# EAGLE board 9-de-8 (EAGLE 6.6.0), part 1 of 3
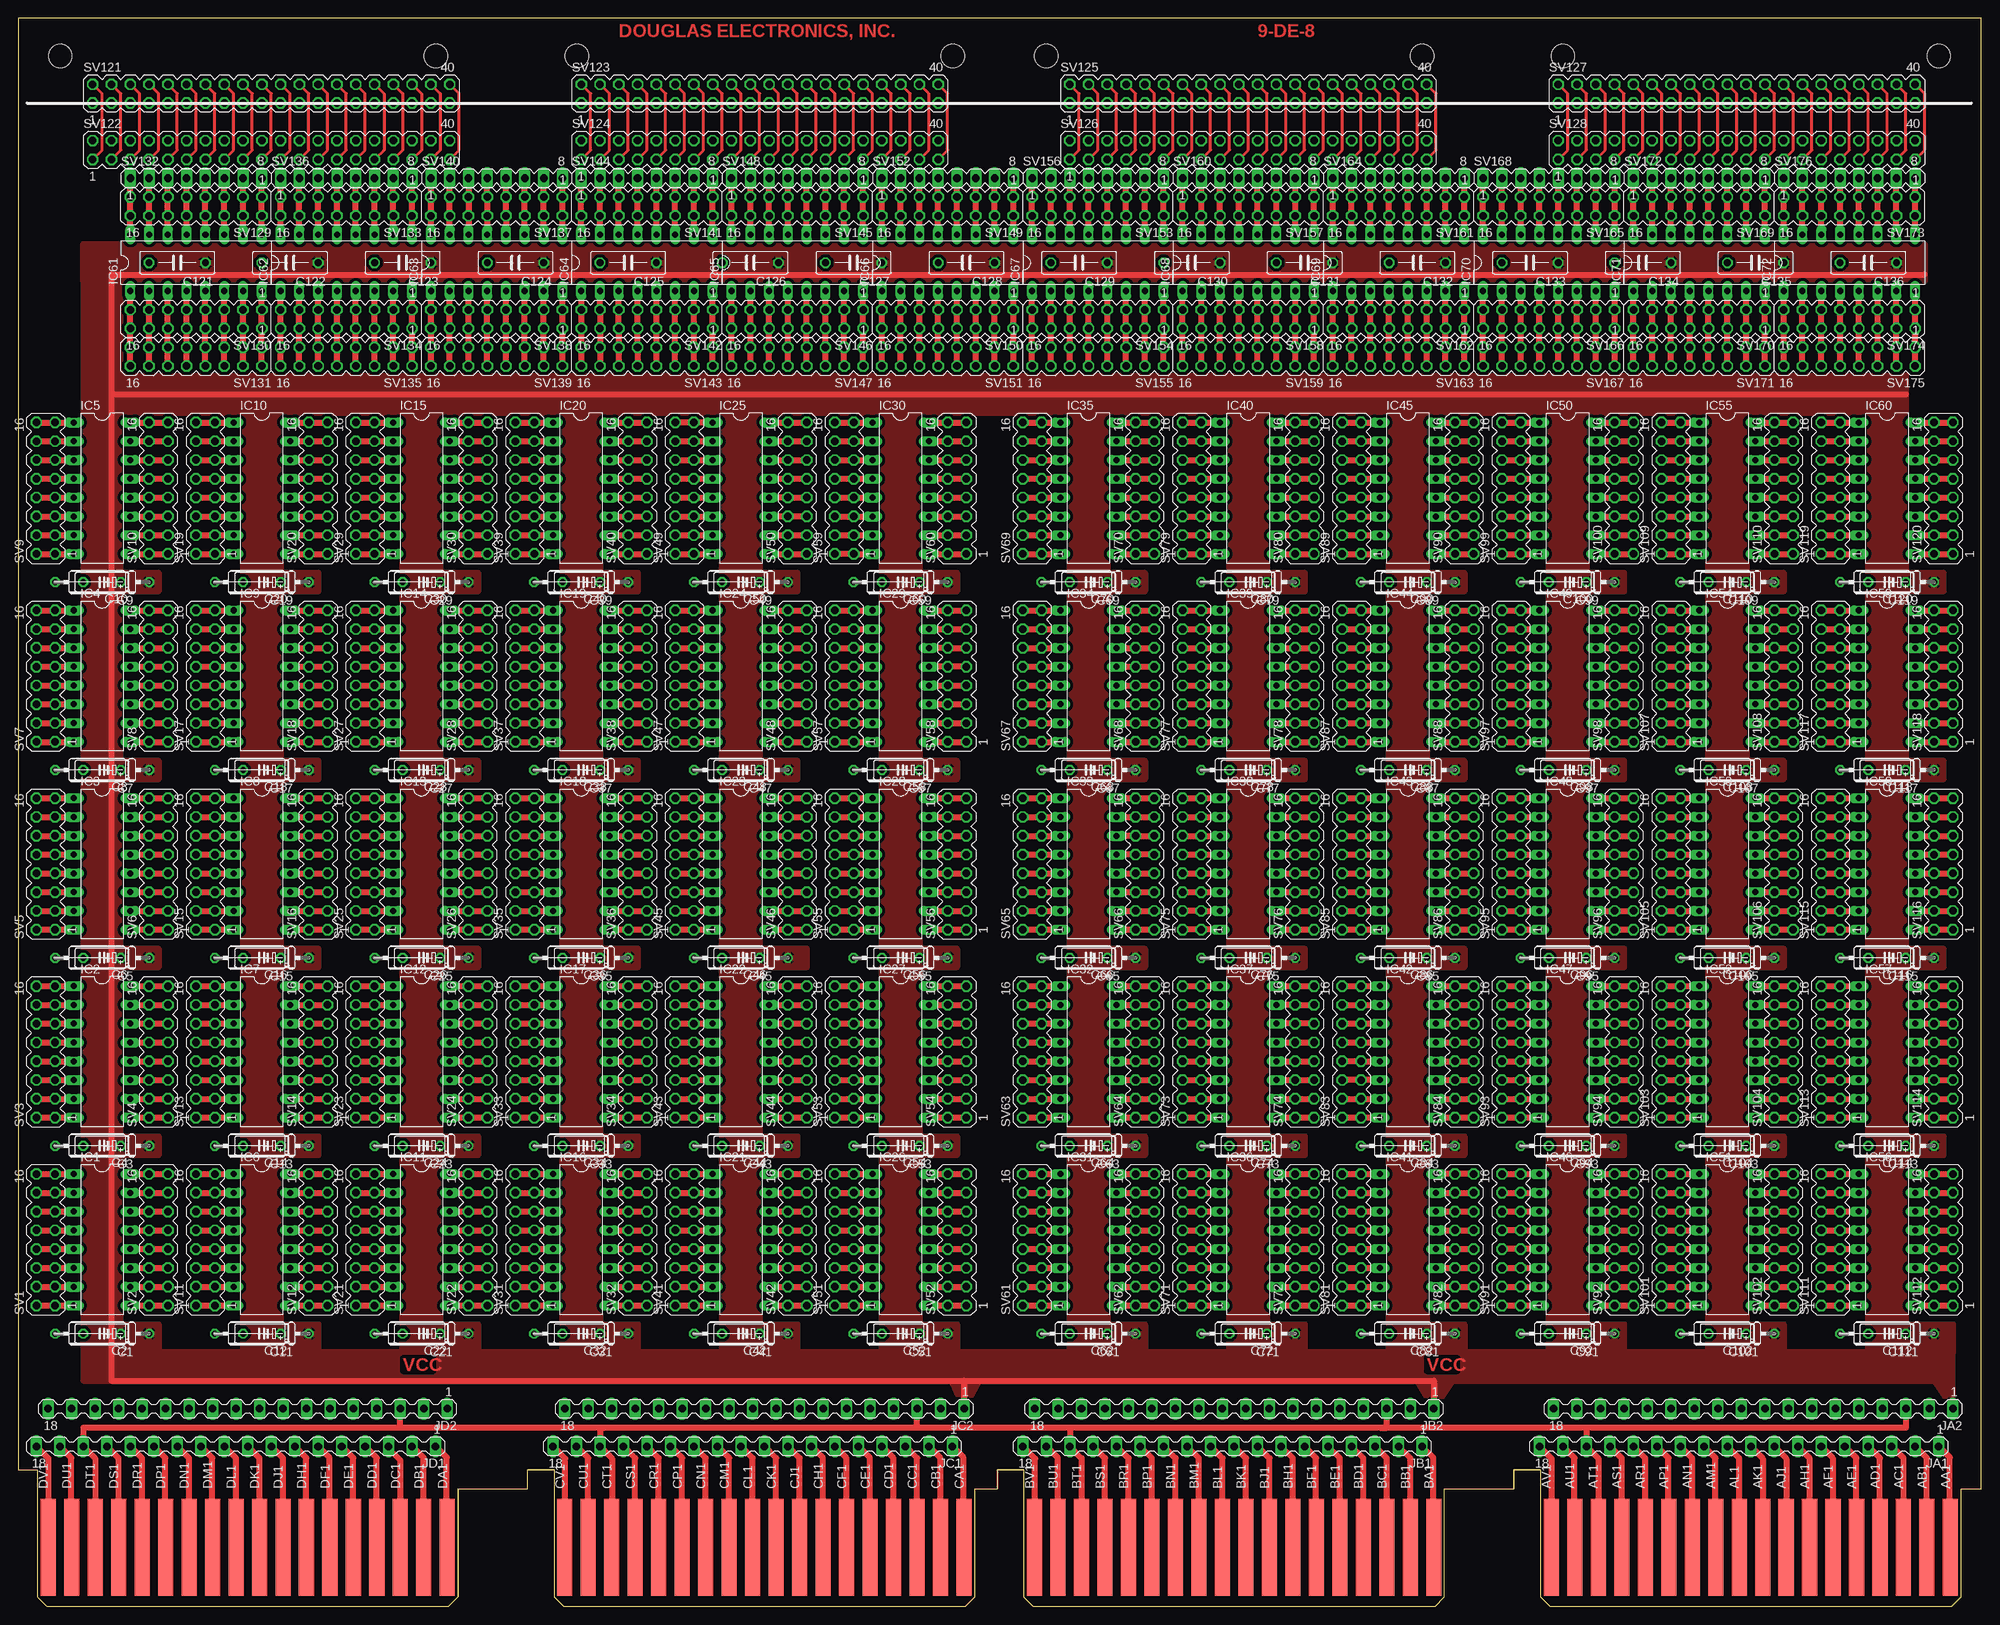
[diagram p3: board, top side]
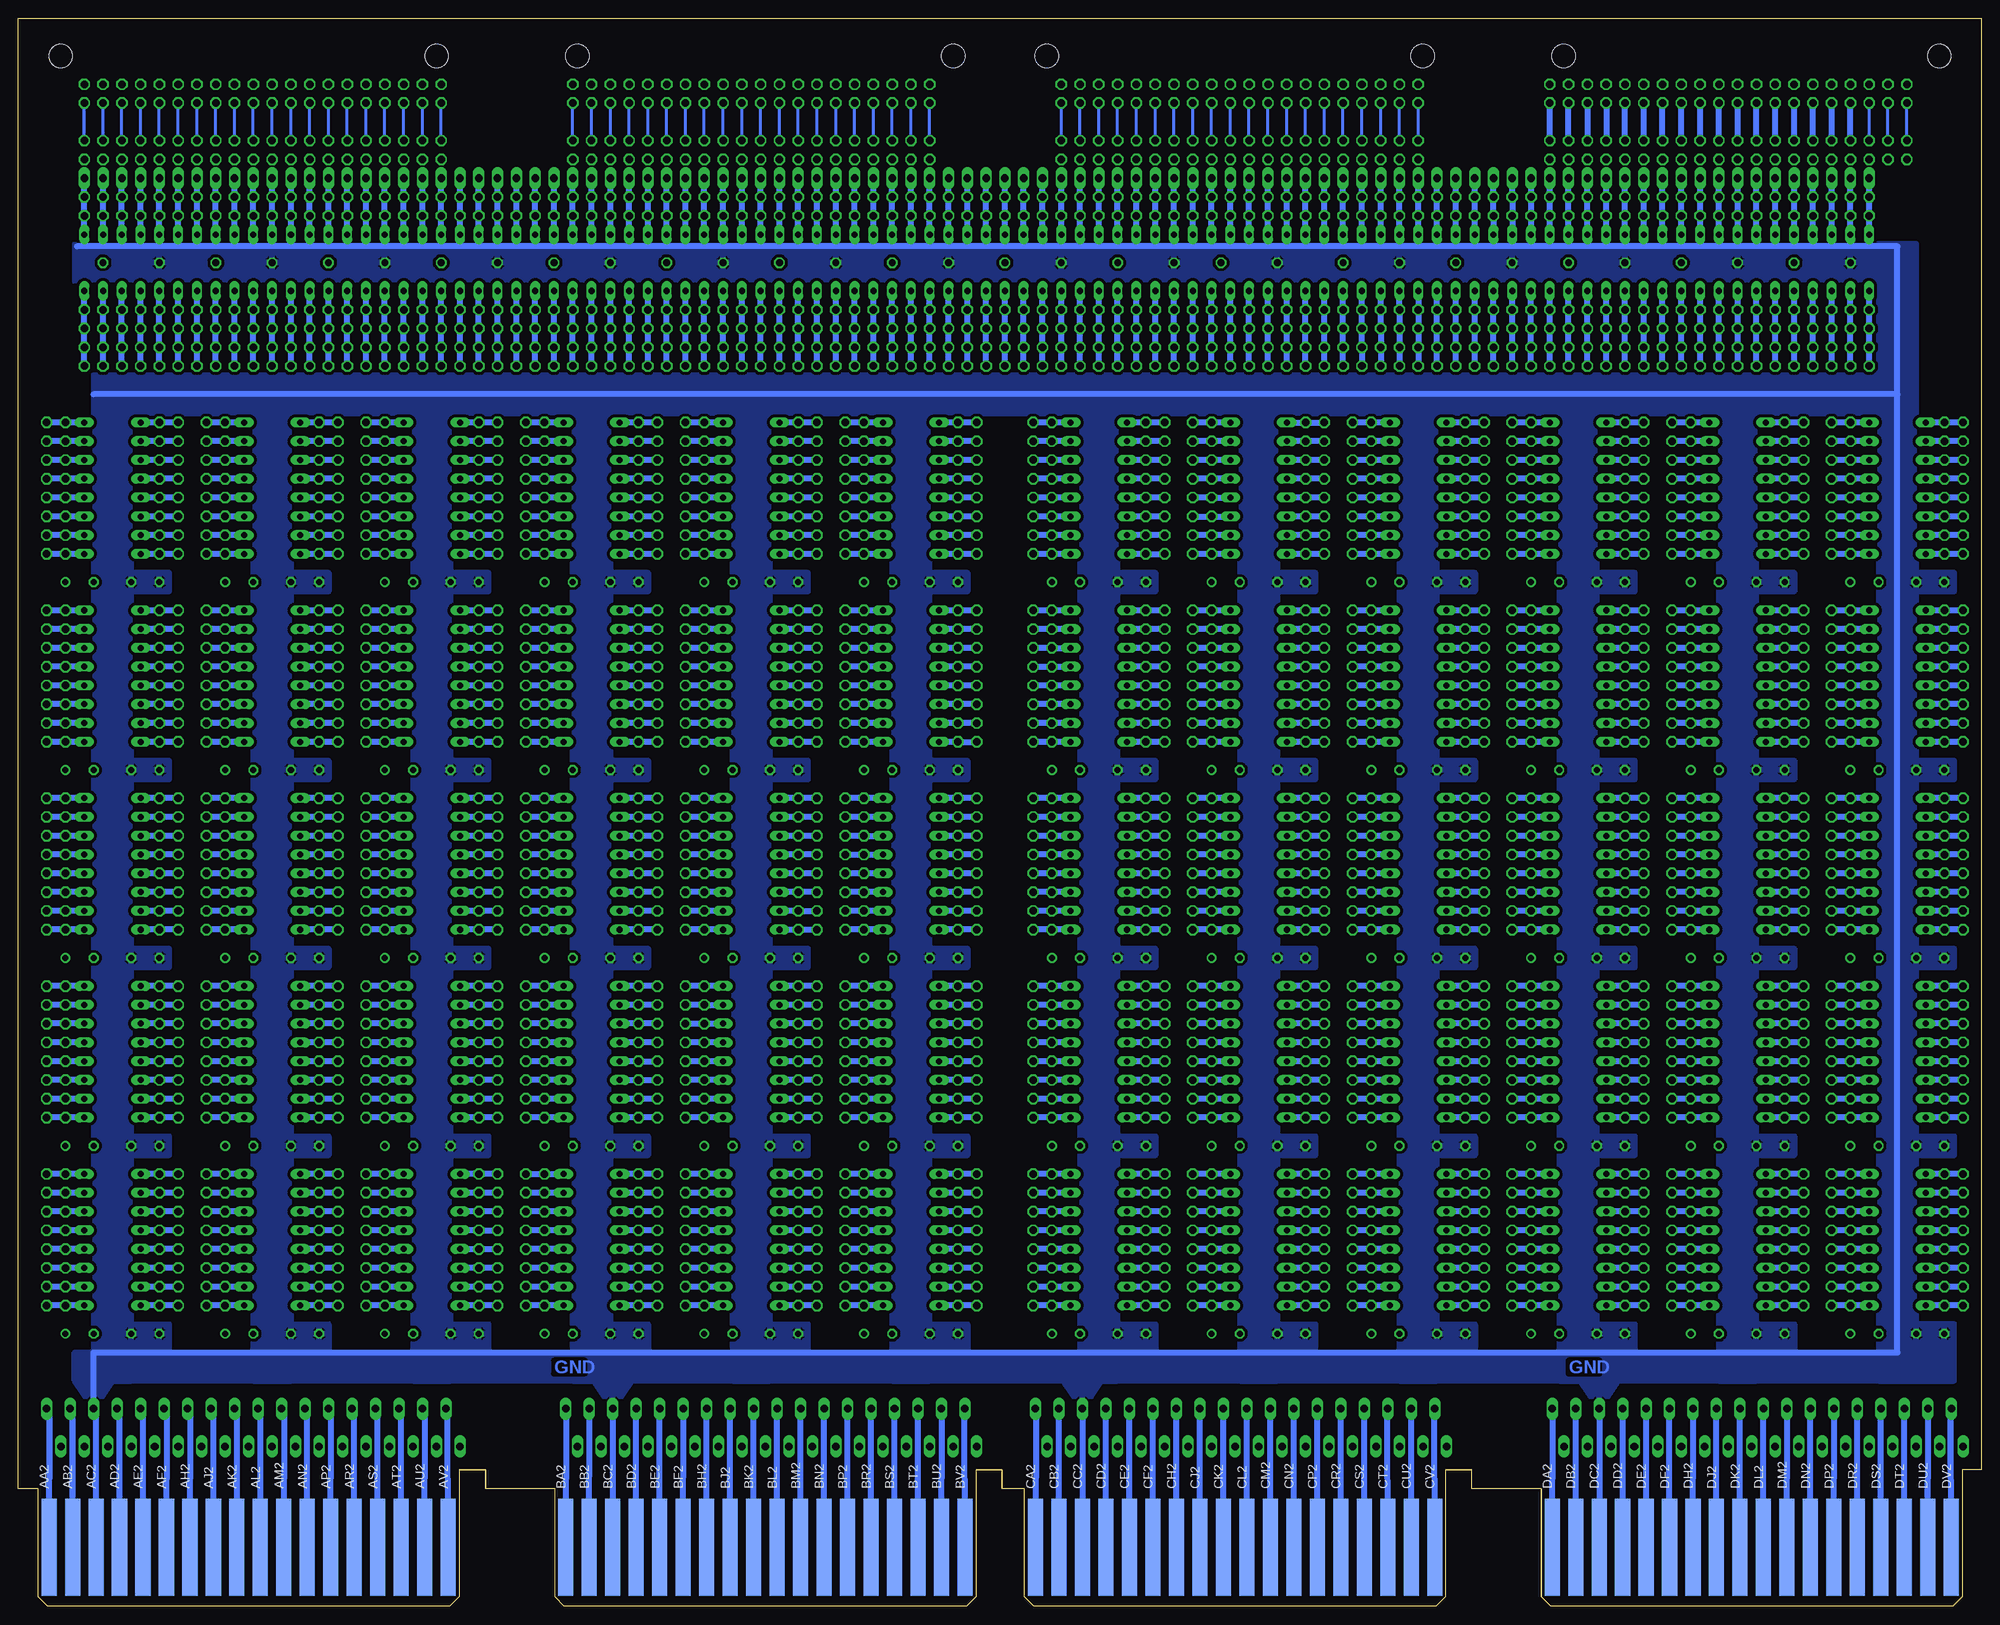
[diagram p4: board, bottom side, seen from below]

Size 265.3 x 214.63 mm. Coordinates in mm from the lower left corner, seen from the top.
Copper layers (1+16): Top 0.035mm / dielectric 1.5mm / Bottom 0.035mm
Design rules "16mils": minimum track width 16mil, minimum drill 32mil, track to track 15mil, track to pad 10mil, pad to pad 10mil, via to via 10mil, smd to smd 10mil, copper to edge 13mil, drill to drill 10mil, minimum pad ring 10mil, minimum via ring 8mil, stop-mask expansion 0mil, vias tented up to drill 0mil, thermal gap 10mil
Net classes: 1 supply: width 0.813 mm

## Footprints (pad centres in the part's own frame; a part is rotated, then mirrored left to right if it is on the bottom)
E12-4 = drill 0.813: + -7.62,0 | drill 0.813 octagon: - 5.08,0
C050-025X075 = drill 0.813 octagon: 1 -2.54,0; 2 2.54,0
C075-032X103 = drill 0.914 octagon: 1 -3.81,0; 2 3.81,0
DIL16 = drill 0.813 long: 1 -8.89,-3.81; 2 -6.35,-3.81; 3 -3.81,-3.81; 4 -1.27,-3.81; 5 1.27,-3.81; 6 3.81,-3.81; 7 6.35,-3.81; 8 8.89,-3.81; 9 8.89,3.81; 10 6.35,3.81; 11 3.81,3.81; 12 1.27,3.81; 13 -1.27,3.81; 14 -3.81,3.81; 15 -6.35,3.81; 16 -8.89,3.81
MA18-1 = drill 1.016 long: 1 -25.4,0; 2 -22.225,0; 3 -19.05,0; 4 -15.875,0; 5 -12.7,0; 6 -9.525,0; 7 -6.35,0; 8 -3.175,0; 9 0,0; 10 3.175,0; 11 6.35,0; 12 9.525,0; 13 12.7,0; 14 15.875,0; 15 19.05,0; 16 22.225,0; 17 25.4,0; 18 28.575,0
MA08-2 = drill 1.016 octagon: 1 -8.89,-1.27; 2 -8.89,1.27; 3 -6.35,-1.27; 4 -6.35,1.27; 5 -3.81,-1.27; 6 -3.81,1.27; 7 -1.27,-1.27; 8 -1.27,1.27; 9 1.27,-1.27; 10 1.27,1.27; 11 3.81,-1.27; 12 3.81,1.27; 13 6.35,-1.27; 14 6.35,1.27; 15 8.89,-1.27; 16 8.89,1.27
MA20-2 = drill 1.016 octagon: 1 -24.13,-1.27; 2 -24.13,1.27; 3 -21.59,-1.27; 4 -21.59,1.27; 5 -19.05,-1.27; 6 -19.05,1.27; 7 -16.51,-1.27; 8 -16.51,1.27; 9 -13.97,-1.27; 10 -13.97,1.27; 11 -11.43,-1.27; 12 -11.43,1.27; 13 -8.89,-1.27; 14 -8.89,1.27; 15 -6.35,-1.27; 16 -6.35,1.27; 17 -3.81,-1.27; 18 -3.81,1.27; 19 -1.27,-1.27; 20 -1.27,1.27; 21 1.27,-1.27; 22 1.27,1.27; 23 3.81,-1.27; 24 3.81,1.27; 25 6.35,-1.27; 26 6.35,1.27; 27 8.89,-1.27; 28 8.89,1.27; 29 11.43,-1.27; 30 11.43,1.27; 31 13.97,-1.27; 32 13.97,1.27; 33 16.51,-1.27; 34 16.51,1.27; 35 19.05,-1.27; 36 19.05,1.27; 37 21.59,-1.27; 38 21.59,1.27; 39 24.13,-1.27; 40 24.13,1.27
MA08-1 = drill 1.016 long: 1 -8.89,0; 2 -6.35,0; 3 -3.81,0; 4 -1.27,0; 5 1.27,0; 6 3.81,0; 7 6.35,0; 8 8.89,0
OMNIBUS = hole 3.175: 208.915,209.55; 259.715,209.55; 189.865,209.55; 139.065,209.55; 75.616,209.55; 126.416,209.55; 56.566,209.55; 5.766,209.55
EDGE-CON8 = smd 2.032 x 13.106: AA1 261.303,7.938; AB1 258.127,7.938; AC1 254.952,7.938; AD1 251.778,7.938; AE1 248.602,7.938; AF1 245.428,7.938; AH1 242.252,7.938; AJ1 239.077,7.938; AK1 235.903,7.938; AL1 232.727,7.938; AM1 229.553,7.938; AN1 226.377,7.938; AP1 223.202,7.938; AR1 220.028,7.938; AS1 216.852,7.938; AT1 213.678,7.938; AU1 210.502,7.938; AV1 207.327,7.938; BA1 191.452,7.938; BB1 188.278,7.938; BC1 185.102,7.938; BD1 181.928,7.938; BE1 178.752,7.938; BF1 175.577,7.938; BH1 172.403,7.938; BJ1 169.227,7.938; BK1 166.053,7.938; BL1 162.877,7.938; BM1 159.702,7.938; BN1 156.528,7.938; BP1 153.352,7.938; BR1 150.178,7.938; BS1 147.002,7.938; BT1 143.827,7.938; BU1 140.653,7.938; BV1 137.477,7.938; CA1 127.953,7.938; CB1 124.778,7.938; CC1 121.603,7.938; CD1 118.427,7.938; CE1 115.252,7.938; CF1 112.078,7.938; CH1 108.903,7.938; CJ1 105.728,7.938; CK1 102.552,7.938; CL1 99.377,7.938; CM1 96.203,7.938; CN1 93.028,7.938; CP1 89.853,7.938; CR1 86.677,7.938; CS1 83.502,7.938; CT1 80.328,7.938; CU1 77.153,7.938; CV1 73.978,7.938; DA1 58.102,7.938; DB1 54.928,7.938; DC1 51.752,7.938; DD1 48.578,7.938; DE1 45.403,7.938; DF1 42.227,7.938; DH1 39.053,7.938; DJ1 35.877,7.938; DK1 32.703,7.938; DL1 29.527,7.938; DM1 26.352,7.938; DN1 23.177,7.938; DP1 20.003,7.938; DR1 16.828,7.938; DS1 13.652,7.938; DT1 10.477,7.938; DU1 7.303,7.938; DV1 4.128,7.938 | smd 2.032 x 13.106 bottom: AA2 261.303,7.938; AB2 258.127,7.938; AC2 254.952,7.938; AD2 251.778,7.938; AE2 248.602,7.938; AF2 245.428,7.938; AH2 242.252,7.938; AJ2 239.077,7.938; AK2 235.903,7.938; AL2 232.727,7.938; AM2 229.553,7.938; AN2 226.377,7.938; AP2 223.202,7.938; AR2 220.028,7.938; AS2 216.852,7.938; AT2 213.678,7.938; AU2 210.502,7.938; AV2 207.327,7.938; BA2 191.452,7.938; BB2 188.278,7.938; BC2 185.102,7.938; BD2 181.928,7.938; BE2 178.752,7.938; BF2 175.577,7.938; BH2 172.403,7.938; BJ2 169.227,7.938; BK2 166.053,7.938; BL2 162.877,7.938; BM2 159.702,7.938; BN2 156.528,7.938; BP2 153.352,7.938; BR2 150.178,7.938; BS2 147.002,7.938; BT2 143.827,7.938; BU2 140.653,7.938; BV2 137.477,7.938; CA2 127.953,7.938; CB2 124.778,7.938; CC2 121.603,7.938; CD2 118.427,7.938; CE2 115.252,7.938; CF2 112.078,7.938; CH2 108.903,7.938; CJ2 105.728,7.938; CK2 102.552,7.938; CL2 99.377,7.938; CM2 96.203,7.938; CN2 93.028,7.938; CP2 89.853,7.938; CR2 86.677,7.938; CS2 83.502,7.938; CT2 80.328,7.938; CU2 77.153,7.938; CV2 73.978,7.938; DA2 58.102,7.938; DB2 54.928,7.938; DC2 51.752,7.938; DD2 48.578,7.938; DE2 45.403,7.938; DF2 42.227,7.938; DH2 39.053,7.938; DJ2 35.877,7.938; DK2 32.703,7.938; DL2 29.527,7.938; DM2 26.352,7.938; DN2 23.177,7.938; DP2 20.003,7.938; DR2 16.828,7.938; DS2 13.652,7.938; DT2 10.477,7.938; DU2 7.303,7.938; DV2 4.128,7.938

## Placement (x,y rotation side)
C1  [E12-4]  10.03,36.83 180 top
C2  [C050-025X075]  11.3,36.83 180 top
C3  [E12-4]  10.03,62.23 180 top
C4  [C050-025X075]  11.3,62.23 180 top
C5  [E12-4]  10.03,87.63 180 top
C6  [C050-025X075]  11.3,87.63 180 top
C7  [E12-4]  10.03,113.03 180 top
C8  [C050-025X075]  11.3,113.03 180 top
C9  [E12-4]  10.03,138.43 180 top
C10  [C050-025X075]  11.3,138.43 180 top
C11  [E12-4]  31.62,36.83 180 top
C12  [C050-025X075]  32.89,36.83 180 top
C13  [E12-4]  31.62,62.23 180 top
C14  [C050-025X075]  32.89,62.23 180 top
C15  [E12-4]  31.62,87.63 180 top
C16  [C050-025X075]  32.89,87.63 180 top
C17  [E12-4]  31.62,113.03 180 top
C18  [C050-025X075]  32.89,113.03 180 top
C19  [E12-4]  31.62,138.43 180 top
C20  [C050-025X075]  32.89,138.43 180 top
C21  [E12-4]  53.21,36.83 180 top
C22  [C050-025X075]  54.48,36.83 180 top
C23  [E12-4]  53.21,62.23 180 top
C24  [C050-025X075]  54.48,62.23 180 top
C25  [E12-4]  53.21,87.63 180 top
C26  [C050-025X075]  54.48,87.63 180 top
C27  [E12-4]  53.21,113.03 180 top
C28  [C050-025X075]  54.48,113.03 180 top
C29  [E12-4]  53.21,138.43 180 top
C30  [C050-025X075]  54.48,138.43 180 top
C31  [E12-4]  74.8,36.83 180 top
C32  [C050-025X075]  76.07,36.83 180 top
C33  [E12-4]  74.8,62.23 180 top
C34  [C050-025X075]  76.07,62.23 180 top
C35  [E12-4]  74.8,87.63 180 top
C36  [C050-025X075]  76.07,87.63 180 top
C37  [E12-4]  74.8,113.03 180 top
C38  [C050-025X075]  76.07,113.03 180 top
C39  [E12-4]  74.8,138.43 180 top
C40  [C050-025X075]  76.07,138.43 180 top
C41  [E12-4]  96.39,36.83 180 top
C42  [C050-025X075]  97.66,36.83 180 top
C43  [E12-4]  96.39,62.23 180 top
C44  [C050-025X075]  97.66,62.23 180 top
C45  [E12-4]  96.39,87.63 180 top
C46  [C050-025X075]  97.66,87.63 180 top
C47  [E12-4]  96.39,113.03 180 top
C48  [C050-025X075]  97.66,113.03 180 top
C49  [E12-4]  96.39,138.43 180 top
C50  [C050-025X075]  97.66,138.43 180 top
C51  [E12-4]  117.98,36.83 180 top
C52  [C050-025X075]  119.25,36.83 180 top
C53  [E12-4]  117.98,62.23 180 top
C54  [C050-025X075]  119.25,62.23 180 top
C55  [E12-4]  117.98,87.63 180 top
C56  [C050-025X075]  119.25,87.63 180 top
C57  [E12-4]  117.98,113.03 180 top
C58  [C050-025X075]  119.25,113.03 180 top
C59  [E12-4]  117.98,138.43 180 top
C60  [C050-025X075]  119.25,138.43 180 top
C61  [E12-4]  143.38,36.83 180 top
C62  [C050-025X075]  144.65,36.83 180 top
C63  [E12-4]  143.38,62.23 180 top
C64  [C050-025X075]  144.65,62.23 180 top
C65  [E12-4]  143.38,87.63 180 top
C66  [C050-025X075]  144.65,87.63 180 top
C67  [E12-4]  143.38,113.03 180 top
C68  [C050-025X075]  144.65,113.03 180 top
C69  [E12-4]  143.38,138.43 180 top
C70  [C050-025X075]  144.65,138.43 180 top
C71  [E12-4]  164.97,36.83 180 top
C72  [C050-025X075]  166.24,36.83 180 top
C73  [E12-4]  164.97,62.23 180 top
C74  [C050-025X075]  166.24,62.23 180 top
C75  [E12-4]  164.97,87.63 180 top
C76  [C050-025X075]  166.24,87.63 180 top
C77  [E12-4]  164.97,113.03 180 top
C78  [C050-025X075]  166.24,113.03 180 top
C79  [E12-4]  164.97,138.43 180 top
C80  [C050-025X075]  166.24,138.43 180 top
C81  [E12-4]  186.56,36.83 180 top
C82  [C050-025X075]  187.83,36.83 180 top
C83  [E12-4]  186.56,62.23 180 top
C84  [C050-025X075]  187.83,62.23 180 top
C85  [E12-4]  186.56,87.63 180 top
C86  [C050-025X075]  187.83,87.63 180 top
C87  [E12-4]  186.56,113.03 180 top
C88  [C050-025X075]  187.83,113.03 180 top
C89  [E12-4]  186.56,138.43 180 top
C90  [C050-025X075]  187.83,138.43 180 top
C91  [E12-4]  208.15,36.83 180 top
C92  [C050-025X075]  209.42,36.83 180 top
C93  [E12-4]  208.15,62.23 180 top
C94  [C050-025X075]  209.42,62.23 180 top
C95  [E12-4]  208.15,87.63 180 top
C96  [C050-025X075]  209.42,87.63 180 top
C97  [E12-4]  208.15,113.03 180 top
C98  [C050-025X075]  209.42,113.03 180 top
C99  [E12-4]  208.15,138.43 180 top
C100  [C050-025X075]  209.42,138.43 180 top
C101  [E12-4]  229.74,36.83 180 top
C102  [C050-025X075]  231.01,36.83 180 top
C103  [E12-4]  229.74,62.23 180 top
C104  [C050-025X075]  231.01,62.23 180 top
C105  [E12-4]  229.74,87.63 180 top
C106  [C050-025X075]  231.01,87.63 180 top
C107  [E12-4]  229.74,113.03 180 top
C108  [C050-025X075]  231.01,113.03 180 top
C109  [E12-4]  229.74,138.43 180 top
C110  [C050-025X075]  231.01,138.43 180 top
C111  [E12-4]  251.33,36.83 180 top
C112  [C050-025X075]  252.6,36.83 180 top
C113  [E12-4]  251.33,62.23 180 top
C114  [C050-025X075]  252.6,62.23 180 top
C115  [E12-4]  251.33,87.63 180 top
C116  [C050-025X075]  252.6,87.63 180 top
C117  [E12-4]  251.33,113.03 180 top
C118  [C050-025X075]  252.6,113.03 180 top
C119  [E12-4]  251.33,138.43 180 top
C120  [C050-025X075]  252.6,138.43 180 top
C121  [C075-032X103]  21.46,181.61 180 top
C122  [C075-032X103]  36.7,181.61 180 top
C123  [C075-032X103]  51.94,181.61 180 top
C124  [C075-032X103]  67.18,181.61 180 top
C125  [C075-032X103]  82.42,181.61 180 top
C126  [C075-032X103]  98.93,181.61 180 top
C127  [C075-032X103]  112.9,181.61 180 top
C128  [C075-032X103]  128.14,181.61 180 top
C129  [C075-032X103]  143.38,181.61 180 top
C130  [C075-032X103]  158.62,181.61 180 top
C131  [C075-032X103]  173.86,181.61 180 top
C132  [C075-032X103]  189.1,181.61 180 top
C133  [C075-032X103]  204.34,181.61 180 top
C134  [C075-032X103]  219.58,181.61 180 top
C135  [C075-032X103]  234.82,181.61 180 top
C136  [C075-032X103]  250.06,181.61 180 top
IC1  [DIL16]  11.3,49.53 270 top
IC2  [DIL16]  11.3,74.93 270 top
IC3  [DIL16]  11.3,100.33 270 top
IC4  [DIL16]  11.3,125.73 270 top
IC5  [DIL16]  11.3,151.13 270 top
IC6  [DIL16]  32.89,49.53 270 top
IC7  [DIL16]  32.89,74.93 270 top
IC8  [DIL16]  32.89,100.33 270 top
IC9  [DIL16]  32.89,125.73 270 top
IC10  [DIL16]  32.89,151.13 270 top
IC11  [DIL16]  54.48,49.53 270 top
IC12  [DIL16]  54.48,74.93 270 top
IC13  [DIL16]  54.48,100.33 270 top
IC14  [DIL16]  54.48,125.73 270 top
IC15  [DIL16]  54.48,151.13 270 top
IC16  [DIL16]  76.07,49.53 270 top
IC17  [DIL16]  76.07,74.93 270 top
IC18  [DIL16]  76.07,100.33 270 top
IC19  [DIL16]  76.07,125.73 270 top
IC20  [DIL16]  76.07,151.13 270 top
IC21  [DIL16]  97.66,49.53 270 top
IC22  [DIL16]  97.66,74.93 270 top
IC23  [DIL16]  97.66,100.33 270 top
IC24  [DIL16]  97.66,125.73 270 top
IC25  [DIL16]  97.66,151.13 270 top
IC26  [DIL16]  119.25,49.53 270 top
IC27  [DIL16]  119.25,74.93 270 top
IC28  [DIL16]  119.25,100.33 270 top
IC29  [DIL16]  119.25,125.73 270 top
IC30  [DIL16]  119.25,151.13 270 top
IC31  [DIL16]  144.65,49.53 270 top
IC32  [DIL16]  144.65,74.93 270 top
IC33  [DIL16]  144.65,100.33 270 top
IC34  [DIL16]  144.65,125.73 270 top
IC35  [DIL16]  144.65,151.13 270 top
IC36  [DIL16]  166.24,49.53 270 top
IC37  [DIL16]  166.24,74.93 270 top
IC38  [DIL16]  166.24,100.33 270 top
IC39  [DIL16]  166.24,125.73 270 top
IC40  [DIL16]  166.24,151.13 270 top
IC41  [DIL16]  187.83,49.53 270 top
IC42  [DIL16]  187.83,74.93 270 top
IC43  [DIL16]  187.83,100.33 270 top
IC44  [DIL16]  187.83,125.73 270 top
IC45  [DIL16]  187.83,151.13 270 top
IC46  [DIL16]  209.42,49.53 270 top
IC47  [DIL16]  209.42,74.93 270 top
IC48  [DIL16]  209.42,100.33 270 top
IC49  [DIL16]  209.42,125.73 270 top
IC50  [DIL16]  209.42,151.13 270 top
IC51  [DIL16]  231.01,49.53 270 top
IC52  [DIL16]  231.01,74.93 270 top
IC53  [DIL16]  231.01,100.33 270 top
IC54  [DIL16]  231.01,125.73 270 top
IC55  [DIL16]  231.01,151.13 270 top
IC56  [DIL16]  252.6,49.53 270 top
IC57  [DIL16]  252.6,74.93 270 top
IC58  [DIL16]  252.6,100.33 270 top
IC59  [DIL16]  252.6,125.73 270 top
IC60  [DIL16]  252.6,151.13 270 top
IC61  [DIL16]  24,181.61 0 top
IC62  [DIL16]  44.32,181.61 0 top
IC63  [DIL16]  64.64,181.61 0 top
IC64  [DIL16]  84.96,181.61 0 top
IC65  [DIL16]  105.28,181.61 0 top
IC66  [DIL16]  125.6,181.61 0 top
IC67  [DIL16]  145.92,181.61 0 top
IC68  [DIL16]  166.24,181.61 0 top
IC69  [DIL16]  186.56,181.61 0 top
IC70  [DIL16]  206.88,181.61 0 top
IC71  [DIL16]  227.2,181.61 0 top
IC72  [DIL16]  247.52,181.61 0 top
JA1  MA18-1  [MA18-1]  234.19,21.59 180 top
JA2  MA18-1  [MA18-1]  236.09,26.67 180 top
JB1  MA18-1  [MA18-1]  164.34,21.59 180 top
JB2  MA18-1  [MA18-1]  165.93,26.67 180 top
JC1  MA18-1  [MA18-1]  100.84,21.59 180 top
JC2  MA18-1  [MA18-1]  102.43,26.67 180 top
JD1  MA18-1  [MA18-1]  30.99,21.59 180 top
JD2  MA18-1  [MA18-1]  32.58,26.67 180 top
SV1  [MA08-2]  3.68,49.53 90 top
SV2  [MA08-2]  18.92,49.53 90 top
SV3  [MA08-2]  3.68,74.93 90 top
SV4  [MA08-2]  18.92,74.93 90 top
SV5  [MA08-2]  3.68,100.33 90 top
SV6  [MA08-2]  18.92,100.33 90 top
SV7  [MA08-2]  3.68,125.73 90 top
SV8  [MA08-2]  18.92,125.73 90 top
SV9  [MA08-2]  3.68,151.13 90 top
SV10  [MA08-2]  18.92,151.13 90 top
SV11  [MA08-2]  25.27,49.53 90 top
SV12  [MA08-2]  40.51,49.53 90 top
SV13  [MA08-2]  25.27,74.93 90 top
SV14  [MA08-2]  40.51,74.93 90 top
SV15  [MA08-2]  25.27,100.33 90 top
SV16  [MA08-2]  40.51,100.33 90 top
SV17  [MA08-2]  25.27,125.73 90 top
SV18  [MA08-2]  40.51,125.73 90 top
SV19  [MA08-2]  25.27,151.13 90 top
SV20  [MA08-2]  40.51,151.13 90 top
SV21  [MA08-2]  46.86,49.53 90 top
SV22  [MA08-2]  62.1,49.53 90 top
SV23  [MA08-2]  46.86,74.93 90 top
SV24  [MA08-2]  62.1,74.93 90 top
SV25  [MA08-2]  46.86,100.33 90 top
SV26  [MA08-2]  62.1,100.33 90 top
SV27  [MA08-2]  46.86,125.73 90 top
SV28  [MA08-2]  62.1,125.73 90 top
SV29  [MA08-2]  46.86,151.13 90 top
SV30  [MA08-2]  62.1,151.13 90 top
SV31  [MA08-2]  68.45,49.53 90 top
SV32  [MA08-2]  83.69,49.53 90 top
SV33  [MA08-2]  68.45,74.93 90 top
SV34  [MA08-2]  83.69,74.93 90 top
SV35  [MA08-2]  68.45,100.33 90 top
SV36  [MA08-2]  83.69,100.33 90 top
SV37  [MA08-2]  68.45,125.73 90 top
SV38  [MA08-2]  83.69,125.73 90 top
SV39  [MA08-2]  68.45,151.13 90 top
SV40  [MA08-2]  83.69,151.13 90 top
SV41  [MA08-2]  90.04,49.53 90 top
SV42  [MA08-2]  105.28,49.53 90 top
SV43  [MA08-2]  90.04,74.93 90 top
SV44  [MA08-2]  105.28,74.93 90 top
SV45  [MA08-2]  90.04,100.33 90 top
SV46  [MA08-2]  105.28,100.33 90 top
SV47  [MA08-2]  90.04,125.73 90 top
SV48  [MA08-2]  105.28,125.73 90 top
SV49  [MA08-2]  90.04,151.13 90 top
SV50  [MA08-2]  105.28,151.13 90 top
SV51  [MA08-2]  111.63,49.53 90 top
SV52  [MA08-2]  126.87,49.53 90 top
SV53  [MA08-2]  111.63,74.93 90 top
SV54  [MA08-2]  126.87,74.93 90 top
SV55  [MA08-2]  111.63,100.33 90 top
SV56  [MA08-2]  126.87,100.33 90 top
SV57  [MA08-2]  111.63,125.73 90 top
SV58  [MA08-2]  126.87,125.73 90 top
SV59  [MA08-2]  111.63,151.13 90 top
SV60  [MA08-2]  126.87,151.13 90 top
SV61  [MA08-2]  137.03,49.53 90 top
SV62  [MA08-2]  152.27,49.53 90 top
SV63  [MA08-2]  137.03,74.93 90 top
SV64  [MA08-2]  152.27,74.93 90 top
SV65  [MA08-2]  137.03,100.33 90 top
SV66  [MA08-2]  152.27,100.33 90 top
SV67  [MA08-2]  137.03,125.73 90 top
SV68  [MA08-2]  152.27,125.73 90 top
SV69  [MA08-2]  137.03,151.13 90 top
SV70  [MA08-2]  152.27,151.13 90 top
SV71  [MA08-2]  158.62,49.53 90 top
SV72  [MA08-2]  173.86,49.53 90 top
SV73  [MA08-2]  158.62,74.93 90 top
SV74  [MA08-2]  173.86,74.93 90 top
SV75  [MA08-2]  158.62,100.33 90 top
SV76  [MA08-2]  173.86,100.33 90 top
SV77  [MA08-2]  158.62,125.73 90 top
SV78  [MA08-2]  173.86,125.73 90 top
SV79  [MA08-2]  158.62,151.13 90 top
SV80  [MA08-2]  173.86,151.13 90 top
SV81  [MA08-2]  180.21,49.53 90 top
SV82  [MA08-2]  195.45,49.53 90 top
SV83  [MA08-2]  180.21,74.93 90 top
SV84  [MA08-2]  195.45,74.93 90 top
SV85  [MA08-2]  180.21,100.33 90 top
SV86  [MA08-2]  195.45,100.33 90 top
SV87  [MA08-2]  180.21,125.73 90 top
SV88  [MA08-2]  195.45,125.73 90 top
SV89  [MA08-2]  180.21,151.13 90 top
SV90  [MA08-2]  195.45,151.13 90 top
SV91  [MA08-2]  201.8,49.53 90 top
SV92  [MA08-2]  217.04,49.53 90 top
SV93  [MA08-2]  201.8,74.93 90 top
SV94  [MA08-2]  217.04,74.93 90 top
SV95  [MA08-2]  201.8,100.33 90 top
SV96  [MA08-2]  217.04,100.33 90 top
SV97  [MA08-2]  201.8,125.73 90 top
SV98  [MA08-2]  217.04,125.73 90 top
SV99  [MA08-2]  201.8,151.13 90 top
SV100  [MA08-2]  217.04,151.13 90 top
SV101  [MA08-2]  223.39,49.53 90 top
SV102  [MA08-2]  238.63,49.53 90 top
SV103  [MA08-2]  223.39,74.93 90 top
SV104  [MA08-2]  238.63,74.93 90 top
SV105  [MA08-2]  223.39,100.33 90 top
SV106  [MA08-2]  238.63,100.33 90 top
SV107  [MA08-2]  223.39,125.73 90 top
SV108  [MA08-2]  238.63,125.73 90 top
SV109  [MA08-2]  223.39,151.13 90 top
SV110  [MA08-2]  238.63,151.13 90 top
SV111  [MA08-2]  244.98,49.53 90 top
SV112  [MA08-2]  260.22,49.53 90 top
SV113  [MA08-2]  244.98,74.93 90 top
SV114  [MA08-2]  260.22,74.93 90 top
SV115  [MA08-2]  244.98,100.33 90 top
SV116  [MA08-2]  260.22,100.33 90 top
SV117  [MA08-2]  244.98,125.73 90 top
SV118  [MA08-2]  260.22,125.73 90 top
SV119  [MA08-2]  244.98,151.13 90 top
SV120  [MA08-2]  260.22,151.13 90 top
SV121  [MA20-2]  34.16,204.47 0 top
SV122  [MA20-2]  34.16,196.85 0 top
SV123  [MA20-2]  100.2,204.47 0 top
SV124  [MA20-2]  100.2,196.85 0 top
SV125  [MA20-2]  166.24,204.47 0 top
SV126  [MA20-2]  166.24,196.85 0 top
SV127  [MA20-2]  232.28,204.47 0 top
SV128  [MA20-2]  232.28,196.85 0 top
SV129  [MA08-2]  24,189.23 180 top
SV130  [MA08-2]  24,173.99 180 top
SV131  [MA08-2]  24,168.91 180 top
SV132  [MA08-1]  24,193.04 0 top
SV133  [MA08-2]  44.32,189.23 180 top
SV134  [MA08-2]  44.32,173.99 180 top
SV135  [MA08-2]  44.32,168.91 180 top
SV136  [MA08-1]  44.32,193.04 0 top
SV137  [MA08-2]  64.64,189.23 180 top
SV138  [MA08-2]  64.64,173.99 180 top
SV139  [MA08-2]  64.64,168.91 180 top
SV140  [MA08-1]  64.64,193.04 0 top
SV141  [MA08-2]  84.96,189.23 180 top
SV142  [MA08-2]  84.96,173.99 180 top
SV143  [MA08-2]  84.96,168.91 180 top
SV144  [MA08-1]  84.96,193.04 0 top
SV145  [MA08-2]  105.28,189.23 180 top
SV146  [MA08-2]  105.28,173.99 180 top
SV147  [MA08-2]  105.28,168.91 180 top
SV148  [MA08-1]  105.28,193.04 0 top
SV149  [MA08-2]  125.6,189.23 180 top
SV150  [MA08-2]  125.6,173.99 180 top
SV151  [MA08-2]  125.6,168.91 180 top
SV152  [MA08-1]  125.6,193.04 0 top
SV153  [MA08-2]  145.92,189.23 180 top
SV154  [MA08-2]  145.92,173.99 180 top
SV155  [MA08-2]  145.92,168.91 180 top
SV156  [MA08-1]  145.92,193.04 0 top
SV157  [MA08-2]  166.24,189.23 180 top
SV158  [MA08-2]  166.24,173.99 180 top
SV159  [MA08-2]  166.24,168.91 180 top
SV160  [MA08-1]  166.24,193.04 0 top
SV161  [MA08-2]  186.56,189.23 180 top
SV162  [MA08-2]  186.56,173.99 180 top
SV163  [MA08-2]  186.56,168.91 180 top
SV164  [MA08-1]  186.56,193.04 0 top
SV165  [MA08-2]  206.88,189.23 180 top
SV166  [MA08-2]  206.88,173.99 180 top
SV167  [MA08-2]  206.88,168.91 180 top
SV168  [MA08-1]  206.88,193.04 0 top
SV169  [MA08-2]  227.2,189.23 180 top
SV170  [MA08-2]  227.2,173.99 180 top
SV171  [MA08-2]  227.2,168.91 180 top
SV172  [MA08-1]  227.2,193.04 0 top
SV173  [MA08-2]  247.52,189.23 180 top
SV174  [MA08-2]  247.52,173.99 180 top
SV175  [MA08-2]  247.52,168.91 180 top
SV176  [MA08-1]  247.52,193.04 0 top
U$1  OUTLINE-OMNIBUS  [OMNIBUS]  -0.13,0 0 top
U$2  [EDGE-CON8]  -0.13,0 0 top

## Tracks (layer width: path | path; a pad name or v marks a point on that pad's centre or on a via)
!BREAK_CYCLE
  Bottom 0.813: U$2.BL2 162.76,26.66 JB2.10
!BRK_DATA_CONT
  Bottom 0.813: JB2.9 166.24,26.67 165.94,26.36 U$2.BK2
!BRK_IN_PROG
  Bottom 0.813: JB2.5 178.94,26.67 178.61,26.34 U$2.BE2
!BUS_STROBE
  Top 0.813: U$2.CK1 102.44,19.99 JC1.9
!C0
  Top 0.813: U$2.CE1 115.11,20.02 JC1.5
!C1
  Top 0.813: U$2.CH1 108.76,20.02 JC1.7
!C2
  Top 0.813: U$2.CJ1 105.61,19.99 JC1.8
!CPMA_DISABLE
  Top 0.813: U$2.CU1 77.01,20.02 JC1.17
!D
  Bottom 0.813: U$2.DK2 32.59,26.36 JD2.9
!DATA0
  Top 0.813: U$2.AR1 219.91,19.99 JA1.14
!DATA1
  Top 0.813: U$2.AS1 216.74,19.99 JA1.15
!DATA2
  Top 0.813: U$2.AU1 210.36,20.02 JA1.17
!DATA3
  Top 0.813: U$2.AV1 207.28,19.93 JA1.18
!DATA4
  Top 0.813: U$2.BR1 150.06,19.99 JB1.14
!DATA5
  Top 0.813: U$2.BS1 146.89,19.99 JB1.15
!DATA6
  Top 0.813: U$2.BU1 140.51,20.02 JB1.17
!DATA7
  Top 0.813: U$2.BV1 137.43,19.93 JB1.18
!DATA8
  Top 0.813: U$2.DR1 16.71,19.99 JD1.14
!DATA9
  Top 0.813: U$2.DS1 13.54,19.99 JD1.15
!DATA10
  Top 0.813: U$2.DU1 7.16,20.02 JD1.17
!DATA11
  Top 0.813: U$2.DV1 4.08,19.93 JD1.18
!E
  Bottom 0.813: U$2.DL2 29.41,26.36 JD2.10
!EMA0
  Bottom 0.813: U$2.AD2 251.64,26.34 JA2.4
!EMA1
  Bottom 0.813: U$2.AE2 248.46,26.34 JA2.5
!EMA2
  Bottom 0.813: U$2.AH2 242.11,26.34 JA2.7
!F
  Bottom 0.813: U$2.DJ2 35.76,26.36 JD2.8
!FSET
  Bottom 0.813: U$2.DP2 19.86,26.34 JD2.13
!IND1
  Bottom 0.813: U$2.CU2 76.99,26.63 JC2.17
!IND2
  Bottom 0.813: U$2.CV2 73.93,26.67 JC2.18
!INT_RQST
  Top 0.813: U$2.CP1 89.71,20.02 JC1.13
!INTERNAL_IO
  Top 0.813: U$2.CL1 99.26,19.99 JC1.10
!IO_PAUSE
  Top 0.813: U$2.CD1 118.29,20.02 JC1.4
!IR0
  Bottom 0.813: U$2.DD2 48.44,26.34 JD2.4
!IR1
  Bottom 0.813: U$2.DE2 45.26,26.34 JD2.5
!IR2
  Bottom 0.813: U$2.DH2 38.91,26.34 JD2.7
!KEY_CONT
  Bottom 0.813: U$2.DU2 7.14,26.31 JD2.17
!LA_ENABLE
  Bottom 0.813: JB2.11 159.89,26.67 159.56,26.34 U$2.BM2
!LINK
  Bottom 0.813: U$2.AV2 207.28,26.67 JA2.18
!LINK_DATA
  Bottom 0.813: JC2.14 86.23,26.67 86.56,26.34 U$2.CR2
!LINK_LOAD
  Bottom 0.813: JC2.15 83.38,26.35 83.39,26.34 U$2.CS2
!LOAD_CONT
  Bottom 0.813: JB2.7 172.59,26.67 172.26,26.34 U$2.BH2
!MA00
  Top 0.813: U$2.AD1 251.64,20.02 JA1.4
!MA01
  Top 0.813: U$2.AE1 248.46,20.02 JA1.5
!MA02
  Top 0.813: U$2.AH1 242.11,20.02 JA1.7
!MA03
  Top 0.813: U$2.AJ1 238.96,19.99 JA1.8
!MA04
  Top 0.813: U$2.BD1 181.79,20.02 JB1.4
!MA05
  Top 0.813: U$2.BE1 178.61,20.02 JB1.5
!MA06
  Top 0.813: U$2.BH1 172.26,20.02 JB1.7
!MA07
  Top 0.813: U$2.BJ1 169.11,19.99 JB1.8
!MA08
  Top 0.813: U$2.DD1 48.44,20.02 JD1.4
!MA09
  Top 0.813: U$2.DE1 45.26,20.02 JD1.5
!MA10
  Top 0.813: U$2.DH1 38.91,20.02 JD1.7
!MA11
  Top 0.813: U$2.DJ1 35.76,19.99 JD1.8
!MD00
  Top 0.813: U$2.AK1 235.79,19.99 JA1.9
!MD01
  Top 0.813: U$2.AL1 232.61,19.99 JA1.10
!MD02
  Top 0.813: U$2.AM1 229.41,20.02 JA1.11
!MD03
  Top 0.813: U$2.AP1 223.06,20.02 JA1.13
!MD04
  Top 0.813: U$2.BK1 165.94,19.99 JB1.9
!MD05
  Top 0.813: U$2.BL1 162.76,19.99 JB1.10
!MD06
  Top 0.813: U$2.BM1 159.56,20.02 JB1.11
!MD07
  Top 0.813: U$2.BP1 153.21,20.02 JB1.13
!MD08
  Top 0.813: U$2.DK1 32.59,19.99 JD1.9
!MD09
  Top 0.813: U$2.DL1 29.41,19.99 JD1.10
!MD10
  Top 0.813: U$2.DM1 26.21,20.02 JD1.11
!MD11
  Top 0.813: U$2.DP1 19.86,20.02 JD1.13
!MD_DIR
  Bottom 0.813: U$2.AK2 235.79,26.36 JA2.9
!MEM_START
  Bottom 0.813: JA2.8 239.59,26.67 238.96,26.05 U$2.AJ2
!MS_DISABLE
  Top 0.813: U$2.CV1 73.93,19.93 JC1.18
!NOT_LAST_TR
  Top 0.813: U$2.CM1 96.06,20.02 JC1.11
!NTS_STALL
  Bottom 0.813: U$2.BR2 150.06,26.66 JB2.14
!OVERFLOW
  Bottom 0.813: U$2.BJ2 169.11,26.66 JB2.8
!ROM_ADDR
  Bottom 0.813: U$2.AU2 210.34,26.31 JA2.17
!RUN
  Bottom 0.813: JB2.17 140.84,26.67 140.49,26.31 U$2.BU2
!SKIP
  Top 0.813: U$2.CS1 83.39,19.99 JC1.15
!STOP
  Bottom 0.813: U$2.DS2 13.54,26.36 JD2.15
!TS1
  Bottom 0.813: JC2.9 102.74,26.35 102.44,26.05 U$2.CK2
!TS2
  Bottom 0.813: JC2.10 98.93,26.67 99.26,26.34 U$2.CL2
!TS3
  Bottom 0.813: JC2.11 96.39,26.67 96.06,26.34 U$2.CM2
!TS4
  Bottom 0.813: JC2.13 89.73,26.99 89.71,26.98 U$2.CP2
!USER_MODE
  Bottom 0.813: U$2.DM2 26.21,26.34 JD2.11
+15V
  Bottom 0.813: U$2.DA2 57.9,26.27 JD2.1
GND
  Top 0.813: U$2.DT1 10.36,19.99 JD1.16 8.76,24.13 51.62,24.13 | 51.62,24.13 JD2.3 | 78.61,24.13 51.62,24.13 | 78.61,24.13 JC1.16 80.21,19.99 U$2.CT1 | 78.61,24.13 79.25,24.13 | 121.79,24.13 78.61,24.13 | 121.79,24.13 121.48,24.13 JC2.3 | JA2.3 255.14,24.13 211.96,24.13 | 142.11,24.13 121.79,24.13 | 184.02,24.13 142.11,24.13 | 211.96,24.13 184.02,24.13 | 184.02,24.13 184.97,24.13 JB2.3 | 211.96,24.13 JA1.16 213.56,19.99 U$2.AT1 | 142.11,24.13 JB1.16 143.71,19.99 U$2.BT1
  Bottom 0.813: JD2.3 U$2.DC2 | U$2.AC2 254.81,26.34 JA2.3 255.14,34.29 11.3,34.29 11.3,163.83 | JB2.3 185.29,26.67 184.96,26.34 U$2.BC2 | U$2.CC2 121.46,26.66 JC2.3 | 11.3,163.83 11.3,183.83 257.37,183.83 | 11.3,163.83 255.14,163.83
  pour Bottom (isolate 0.406): 257.68,184.15 257.68,179.07 13.84,179.07 13.84,166.37 255.14,166.37 255.14,161.29 8.76,161.29 8.76,184.15
  pour Bottom (isolate 0.406): 257.68,30.48 257.68,34.29 8.76,34.29 8.76,30.48
  pour Bottom (isolate 0.406): 8.76,165.1 13.84,165.1 13.84,30.48 8.76,30.48
  pour Bottom (isolate 0.406): 30.35,165.1 35.43,165.1 35.43,30.48 30.35,30.48
  pour Bottom (isolate 0.406): 51.94,165.1 57.02,165.1 57.02,30.48 51.94,30.48
  pour Bottom (isolate 0.406): 73.53,165.1 78.61,165.1 78.61,30.48 73.53,30.48
  pour Bottom (isolate 0.406): 95.12,165.1 100.2,165.1 100.2,30.48 95.12,30.48
  pour Bottom (isolate 0.406): 116.71,165.1 121.79,165.1 121.79,30.48 116.71,30.48
  pour Bottom (isolate 0.406): 142.11,165.1 147.19,165.1 147.19,30.48 142.11,30.48
  pour Bottom (isolate 0.406): 163.7,165.1 168.78,165.1 168.78,30.48 163.7,30.48
  pour Bottom (isolate 0.406): 185.29,165.1 190.37,165.1 190.37,30.48 185.29,30.48
  pour Bottom (isolate 0.406): 206.88,165.1 211.96,165.1 211.96,30.48 206.88,30.48
  pour Bottom (isolate 0.406): 228.47,165.1 233.55,165.1 233.55,30.48 228.47,30.48
  pour Bottom (isolate 0.406): 250.06,165.1 255.14,165.1 255.14,30.48 250.06,30.48
  pour Bottom (isolate 0.406): 255.14,26.67 257.68,30.48 252.6,30.48
  pour Bottom (isolate 0.406): 184.98,26.67 187.52,30.48 182.44,30.48
  pour Bottom (isolate 0.406): 51.63,26.67 54.17,30.48 49.09,30.48
  pour Bottom (isolate 0.406): 121.48,26.67 124.02,30.48 118.94,30.48
  pour Bottom (isolate 0.406): 3.68,38.1 11.3,38.1 11.3,30.48 3.68,30.48
  pour Bottom (isolate 0.406): 32.89,38.1 25.27,38.1 25.27,33.02 32.89,33.02
  pour Bottom (isolate 0.406): 54.48,38.1 46.86,38.1 46.86,33.02 54.48,33.02
  pour Bottom (isolate 0.406): 76.07,38.1 68.45,38.1 68.45,33.02 76.07,33.02
  pour Bottom (isolate 0.406): 97.66,38.1 90.04,38.1 90.04,33.02 97.66,33.02
  pour Bottom (isolate 0.406): 119.25,38.1 111.63,38.1 111.63,33.02 119.25,33.02
  pour Bottom (isolate 0.406): 144.65,38.1 137.03,38.1 137.03,33.02 144.65,33.02
  pour Bottom (isolate 0.406): 166.24,38.1 158.62,38.1 158.62,33.02 166.24,33.02
  pour Bottom (isolate 0.406): 187.83,38.1 180.21,38.1 180.21,33.02 187.83,33.02
  pour Bottom (isolate 0.406): 209.42,38.1 201.8,38.1 201.8,33.02 209.42,33.02
  pour Bottom (isolate 0.406): 231.01,38.1 223.39,38.1 223.39,33.02 231.01,33.02
  pour Bottom (isolate 0.406): 252.6,38.1 244.98,38.1 244.98,33.02 252.6,33.02
  pour Bottom (isolate 0.406): 3.68,63.5 3.68,60.96 11.3,60.96 11.3,63.5
  pour Bottom (isolate 0.406): 3.68,88.9 3.68,86.36 11.3,86.36 11.3,88.9
  pour Bottom (isolate 0.406): 3.68,114.3 3.68,111.76 11.3,111.76 11.3,114.3
  pour Bottom (isolate 0.406): 3.68,139.7 3.68,137.16 11.3,137.16 11.3,139.7
  pour Bottom (isolate 0.406): 25.27,139.7 25.27,137.16 32.89,137.16 32.89,139.7
  pour Bottom (isolate 0.406): 46.86,139.7 46.86,137.16 54.48,137.16 54.48,139.7
  pour Bottom (isolate 0.406): 46.86,114.3 46.86,111.76 54.48,111.76 54.48,114.3
  pour Bottom (isolate 0.406): 25.27,114.3 25.27,111.76 32.89,111.76 32.89,114.3
  pour Bottom (isolate 0.406): 25.27,88.9 25.27,86.36 32.89,86.36 32.89,88.9
  pour Bottom (isolate 0.406): 25.27,63.5 25.27,60.96 32.89,60.96 32.89,63.5
  pour Bottom (isolate 0.406): 46.86,63.5 46.86,60.96 54.48,60.96 54.48,63.5
  pour Bottom (isolate 0.406): 46.86,88.9 46.86,86.36 54.48,86.36 54.48,88.9
  pour Bottom (isolate 0.406): 68.45,139.7 68.45,137.16 76.07,137.16 76.07,139.7
  pour Bottom (isolate 0.406): 68.45,114.3 68.45,111.76 76.07,111.76 76.07,114.3
  pour Bottom (isolate 0.406): 68.45,88.9 68.45,86.36 76.07,86.36 76.07,88.9
  pour Bottom (isolate 0.406): 68.45,63.5 68.45,60.96 76.07,60.96 76.07,63.5
  pour Bottom (isolate 0.406): 90.04,63.5 90.04,60.96 97.66,60.96 97.66,63.5
  pour Bottom (isolate 0.406): 90.04,88.9 90.04,86.36 97.66,86.36 97.66,88.9
  pour Bottom (isolate 0.406): 90.04,114.3 90.04,111.76 97.66,111.76 97.66,114.3
  pour Bottom (isolate 0.406): 90.04,139.7 90.04,137.16 97.66,137.16 97.66,139.7
  pour Bottom (isolate 0.406): 111.63,139.7 111.63,137.16 119.25,137.16 119.25,139.7
  pour Bottom (isolate 0.406): 111.63,114.3 111.63,111.76 119.25,111.76 119.25,114.3
  pour Bottom (isolate 0.406): 111.63,88.9 111.63,86.36 119.25,86.36 119.25,88.9
  pour Bottom (isolate 0.406): 111.63,63.5 111.63,60.96 119.25,60.96 119.25,63.5
  pour Bottom (isolate 0.406): 137.03,139.7 137.03,137.16 144.65,137.16 144.65,139.7
  pour Bottom (isolate 0.406): 137.03,114.3 137.03,111.76 144.65,111.76 144.65,114.3
  pour Bottom (isolate 0.406): 137.03,88.9 137.03,86.36 144.65,86.36 144.65,88.9
  pour Bottom (isolate 0.406): 137.03,63.5 137.03,60.96 144.65,60.96 144.65,63.5
  pour Bottom (isolate 0.406): 158.62,63.5 158.62,60.96 166.24,60.96 166.24,63.5
  pour Bottom (isolate 0.406): 158.62,88.9 158.62,86.36 166.24,86.36 166.24,88.9
  pour Bottom (isolate 0.406): 158.62,114.3 158.62,111.76 166.24,111.76 166.24,114.3
  pour Bottom (isolate 0.406): 158.62,139.7 158.62,137.16 166.24,137.16 166.24,139.7
  pour Bottom (isolate 0.406): 180.21,139.7 180.21,137.16 187.83,137.16 187.83,139.7
  pour Bottom (isolate 0.406): 180.21,114.3 180.21,111.76 187.83,111.76 187.83,114.3
  pour Bottom (isolate 0.406): 180.21,88.9 180.21,86.36 187.83,86.36 187.83,88.9
  pour Bottom (isolate 0.406): 180.21,63.5 180.21,60.96 187.83,60.96 187.83,63.5
  pour Bottom (isolate 0.406): 201.8,63.5 201.8,60.96 209.42,60.96 209.42,63.5
  pour Bottom (isolate 0.406): 201.8,88.9 201.8,86.36 209.42,86.36 209.42,88.9
  pour Bottom (isolate 0.406): 201.8,114.3 201.8,111.76 209.42,111.76 209.42,114.3
  pour Bottom (isolate 0.406): 201.8,139.7 201.8,137.16 209.42,137.16 209.42,139.7
  pour Bottom (isolate 0.406): 223.39,139.7 223.39,137.16 231.01,137.16 231.01,139.7
  pour Bottom (isolate 0.406): 223.39,114.3 223.39,111.76 231.01,111.76 231.01,114.3
  pour Bottom (isolate 0.406): 223.39,88.9 223.39,86.36 231.01,86.36 231.01,88.9
  pour Bottom (isolate 0.406): 223.39,63.5 223.39,60.96 231.01,60.96 231.01,63.5
  pour Bottom (isolate 0.406): 244.98,63.5 244.98,60.96 252.6,60.96 252.6,63.5
  pour Bottom (isolate 0.406): 244.98,88.9 244.98,86.36 252.6,86.36 252.6,88.9
  pour Bottom (isolate 0.406): 244.98,114.3 244.98,111.76 252.6,111.76 252.6,114.3
  pour Bottom (isolate 0.406): 244.98,139.7 244.98,137.16 252.6,137.16 252.6,139.7
INHIBIT
  Bottom 0.813: U$2.AP2 223.06,26.34 JA2.13
INITIALIZE
  Top 0.813: U$2.CR1 86.56,19.99 JC1.14
INT_IN_PROG
  Bottom 0.813: JB2.13 153.54,26.67 153.21,26.34 U$2.BP2
INT_STROBE
  Bottom 0.813: U$2.BD2 181.79,26.66 JB2.4
N$1
  Top 0.813: IC1.9 SV2.2 SV2.1
  Bottom 0.813: IC1.9 SV2.2 SV2.1
N$18
  Top 0.813: IC1.10 SV2.4 SV2.3
  Bottom 0.813: IC1.10 SV2.4 SV2.3
N$19
  Top 0.813: IC1.11 SV2.6 SV2.5
  Bottom 0.813: IC1.11 SV2.6 SV2.5
N$20
  Top 0.813: IC1.12 SV2.8 SV2.7
  Bottom 0.813: IC1.12 SV2.8 SV2.7
N$21
  Top 0.813: IC1.13 SV2.10 SV2.9
  Bottom 0.813: IC1.13 SV2.10 SV2.9
N$22
  Top 0.813: IC1.14 SV2.12 SV2.11
  Bottom 0.813: IC1.14 SV2.12 SV2.11
N$23
  Top 0.813: IC1.15 SV2.14 SV2.13
  Bottom 0.813: SV2.13 SV2.14 IC1.15
N$24
  Top 0.813: IC1.16 SV2.16 SV2.15
  Bottom 0.813: IC1.16 SV2.16 SV2.15
N$25
  Top 0.813: IC1.8 SV1.1 SV1.2
  Bottom 0.813: IC1.8 SV1.1 SV1.2
N$26
  Top 0.813: IC2.9 SV4.2 SV4.1
  Bottom 0.813: IC2.9 SV4.2 SV4.1
N$27
  Top 0.813: IC2.10 SV4.4 SV4.3
  Bottom 0.813: IC2.10 SV4.4 SV4.3
N$28
  Top 0.813: IC2.11 SV4.6 SV4.5
  Bottom 0.813: SV4.5 SV4.6 IC2.11
N$29
  Top 0.813: IC2.12 SV4.8 SV4.7
  Bottom 0.813: IC2.12 SV4.8 SV4.7
N$30
  Top 0.813: IC2.13 SV4.10 SV4.9
  Bottom 0.813: IC2.13 SV4.10 SV4.9
N$31
  Top 0.813: IC2.14 SV4.12 SV4.11
  Bottom 0.813: IC2.14 SV4.12 SV4.11
N$32
  Top 0.813: IC2.15 SV4.14 SV4.13
  Bottom 0.813: SV4.13 SV4.14 IC2.15
N$33
  Top 0.813: IC2.16 SV4.16 SV4.15
  Bottom 0.813: IC2.16 SV4.16 SV4.15
N$34
  Top 0.813: IC2.8 SV3.1 SV3.2
  Bottom 0.813: SV3.2 SV3.1 IC2.8
N$35
  Top 0.813: IC2.7 SV3.3 SV3.4
  Bottom 0.813: IC2.7 SV3.3 SV3.4
N$36
  Top 0.813: IC2.6 SV3.5 SV3.6
  Bottom 0.813: SV3.6 SV3.5 IC2.6
N$37
  Top 0.813: IC2.5 SV3.7 SV3.8
  Bottom 0.813: SV3.8 SV3.7 IC2.5
N$38
  Top 0.813: IC2.4 SV3.9 SV3.10
  Bottom 0.813: SV3.10 SV3.9 IC2.4
N$39
  Top 0.813: IC2.3 SV3.11 SV3.12
  Bottom 0.813: SV3.12 SV3.11 IC2.3
N$40
  Top 0.813: IC2.2 SV3.13 SV3.14
  Bottom 0.813: SV3.14 SV3.13 IC2.2
N$41
  Top 0.813: IC2.1 SV3.15 SV3.16
  Bottom 0.813: SV3.16 SV3.15 IC2.1
N$42
  Top 0.813: IC1.7 SV1.3 SV1.4
  Bottom 0.813: SV1.4 SV1.3 IC1.7
N$43
  Top 0.813: IC1.6 SV1.5 SV1.6
  Bottom 0.813: SV1.6 SV1.5 IC1.6
N$44
  Top 0.813: IC1.5 SV1.7 SV1.8
  Bottom 0.813: SV1.8 SV1.7 IC1.5
N$45
  Top 0.813: IC1.4 SV1.9 SV1.10
  Bottom 0.813: SV1.10 SV1.9 IC1.4
N$46
  Top 0.813: U$2.AB1 257.99,20.01 JA1.2
N$47
  Top 0.813: U$2.AA1 261.1,20.08 JA1.1
N$48
  Top 0.813: U$2.BB1 188.14,20.01 JB1.2
N$49
  Top 0.813: U$2.BA1 191.25,20.08 JB1.1
N$50
  Top 0.813: U$2.CA1 127.75,20.08 JC1.1
N$51
  Bottom 0.813: JB2.15 147.19,26.67 146.89,26.36 U$2.BS2
N$52
  Top 0.813: U$2.CB1 124.64,20.01 JC1.2
N$53
  Top 0.813: U$2.DA1 57.9,20.08 JD1.1
N$54
  Top 0.813: U$2.DB1 54.79,20.01 JD1.2
N$55
  Top 0.813: IC3.9 SV6.2 SV6.1
  Bottom 0.813: IC3.9 SV6.2 SV6.1
N$56
  Top 0.813: IC3.10 SV6.4 SV6.3
  Bottom 0.813: IC3.10 SV6.4 SV6.3
N$57
  Top 0.813: IC3.11 SV6.6 SV6.5
  Bottom 0.813: IC3.11 SV6.6 SV6.5
N$58
  Top 0.813: IC3.12 SV6.8 SV6.7
  Bottom 0.813: IC3.12 SV6.8 SV6.7
N$59
  Top 0.813: IC3.13 SV6.10 SV6.9
  Bottom 0.813: SV6.9 SV6.10 IC3.13
N$60
  Top 0.813: IC3.14 SV6.12 SV6.11
  Bottom 0.813: IC3.14 SV6.12 SV6.11
N$61
  Top 0.813: IC3.15 SV6.14 SV6.13
  Bottom 0.813: SV6.13 SV6.14 IC3.15
N$62
  Top 0.813: IC3.16 SV6.16 SV6.15
  Bottom 0.813: IC3.16 SV6.16 SV6.15
N$63
  Top 0.813: IC3.8 SV5.1 SV5.2
  Bottom 0.813: SV5.2 SV5.1 IC3.8
N$64
  Top 0.813: IC3.7 SV5.3 SV5.4
  Bottom 0.813: SV5.4 SV5.3 IC3.7
N$65
  Top 0.813: IC3.6 SV5.5 SV5.6
  Bottom 0.813: SV5.6 SV5.5 IC3.6
N$66
  Top 0.813: IC3.5 SV5.7 SV5.8
  Bottom 0.813: SV5.8 SV5.7 IC3.5
N$67
  Top 0.813: IC3.4 SV5.9 SV5.10
  Bottom 0.813: IC3.4 SV5.9 SV5.10
N$68
  Top 0.813: IC3.3 SV5.11 SV5.12
  Bottom 0.813: SV5.12 SV5.11 IC3.3
N$69
  Top 0.813: IC3.2 SV5.13 SV5.14
  Bottom 0.813: IC3.2 SV5.13 SV5.14
N$70
  Top 0.813: IC3.1 SV5.15 SV5.16
  Bottom 0.813: SV5.16 SV5.15 IC3.1
N$71
  Top 0.813: IC4.9 SV8.2 SV8.1
  Bottom 0.813: IC4.9 SV8.2 SV8.1
N$72
  Top 0.813: IC4.10 SV8.4 SV8.3
  Bottom 0.813: SV8.3 SV8.4 IC4.10
N$73
  Top 0.813: IC4.11 SV8.6 SV8.5
  Bottom 0.813: IC4.11 SV8.6 SV8.5
N$74
  Top 0.813: IC4.12 SV8.8 SV8.7
  Bottom 0.813: IC4.12 SV8.8 SV8.7
N$75
  Top 0.813: IC4.13 SV8.10 SV8.9
  Bottom 0.813: SV8.9 SV8.10 IC4.13
N$76
  Top 0.813: IC4.14 SV8.12 SV8.11
  Bottom 0.813: IC4.14 SV8.12 SV8.11
N$77
  Top 0.813: IC4.15 SV8.14 SV8.13
  Bottom 0.813: SV8.13 SV8.14 IC4.15
N$78
  Top 0.813: IC4.16 SV8.16 SV8.15
  Bottom 0.813: IC4.16 SV8.16 SV8.15
N$79
  Top 0.813: IC4.8 SV7.1 SV7.2
  Bottom 0.813: IC4.8 SV7.1 SV7.2
N$80
  Top 0.813: IC4.7 SV7.3 SV7.4
  Bottom 0.813: SV7.4 SV7.3 IC4.7
N$81
  Top 0.813: IC4.6 SV7.5 SV7.6
  Bottom 0.813: IC4.6 SV7.5 SV7.6
N$82
  Top 0.813: IC4.5 SV7.7 SV7.8
  Bottom 0.813: SV7.8 SV7.7 IC4.5
N$83
  Top 0.813: IC4.4 SV7.9 SV7.10
  Bottom 0.813: SV7.10 SV7.9 IC4.4
N$84
  Top 0.813: IC4.3 SV7.11 SV7.12
  Bottom 0.813: IC4.3 SV7.11 SV7.12
N$85
  Top 0.813: IC4.2 SV7.13 SV7.14
  Bottom 0.813: SV7.14 SV7.13 IC4.2
N$86
  Top 0.813: IC4.1 SV7.15 SV7.16
  Bottom 0.813: SV7.16 SV7.15 IC4.1
N$87
  Top 0.813: IC5.9 SV10.2 SV10.1
  Bottom 0.813: IC5.9 SV10.2 SV10.1
N$88
  Top 0.813: IC5.10 SV10.4 SV10.3
  Bottom 0.813: IC5.10 SV10.4 SV10.3
N$89
  Top 0.813: IC5.11 SV10.6 SV10.5
  Bottom 0.813: SV10.5 SV10.6 IC5.11
N$90
  Top 0.813: IC5.12 SV10.8 SV10.7
  Bottom 0.813: IC5.12 SV10.8 SV10.7
N$91
  Top 0.813: IC5.13 SV10.10 SV10.9
  Bottom 0.813: SV10.9 SV10.10 IC5.13
N$92
  Top 0.813: IC5.14 SV10.12 SV10.11
  Bottom 0.813: IC5.14 SV10.12 SV10.11
N$93
  Top 0.813: IC5.15 SV10.14 SV10.13
  Bottom 0.813: SV10.13 SV10.14 IC5.15
N$94
  Top 0.813: IC5.16 SV10.16 SV10.15
  Bottom 0.813: IC5.16 SV10.16 SV10.15
N$95
  Top 0.813: IC5.8 SV9.1 SV9.2
  Bottom 0.813: IC5.8 SV9.1 SV9.2
N$96
  Top 0.813: IC5.7 SV9.3 SV9.4
  Bottom 0.813: SV9.4 SV9.3 IC5.7
N$97
  Top 0.813: IC5.6 SV9.5 SV9.6
  Bottom 0.813: IC5.6 SV9.5 SV9.6
N$98
  Top 0.813: IC5.5 SV9.7 SV9.8
  Bottom 0.813: SV9.8 SV9.7 IC5.5
N$99
  Top 0.813: IC5.4 SV9.9 SV9.10
  Bottom 0.813: IC5.4 SV9.9 SV9.10
N$100
  Top 0.813: IC5.3 SV9.11 SV9.12
  Bottom 0.813: SV9.12 SV9.11 IC5.3
N$101
  Top 0.813: IC5.2 SV9.13 SV9.14
  Bottom 0.813: IC5.2 SV9.13 SV9.14
N$102
  Top 0.813: IC5.1 SV9.15 SV9.16
  Bottom 0.813: SV9.16 SV9.15 IC5.1
N$103
  Top 0.813: IC6.9 SV12.2 SV12.1
  Bottom 0.813: IC6.9 SV12.2 SV12.1
N$104
  Top 0.813: IC6.10 SV12.4 SV12.3
  Bottom 0.813: IC6.10 SV12.4 SV12.3
N$105
  Top 0.813: IC6.11 SV12.6 SV12.5
  Bottom 0.813: IC6.11 SV12.6 SV12.5
N$106
  Top 0.813: IC6.12 SV12.8 SV12.7
  Bottom 0.813: IC6.12 SV12.8 SV12.7
N$107
  Top 0.813: IC6.13 SV12.10 SV12.9
  Bottom 0.813: IC6.13 SV12.10 SV12.9
N$108
  Top 0.813: IC6.14 SV12.12 SV12.11
  Bottom 0.813: IC6.14 SV12.12 SV12.11
N$109
  Top 0.813: IC6.15 SV12.14 SV12.13
  Bottom 0.813: IC6.15 SV12.14 SV12.13
N$110
  Top 0.813: IC6.16 SV12.16 SV12.15
  Bottom 0.813: IC6.16 SV12.16 SV12.15
N$111
  Top 0.813: IC6.8 SV11.1 SV11.2
  Bottom 0.813: SV11.2 SV11.1 IC6.8
N$112
  Top 0.813: IC6.7 SV11.3 SV11.4
  Bottom 0.813: SV11.4 SV11.3 IC6.7
N$113
  Top 0.813: IC6.6 SV11.5 SV11.6
  Bottom 0.813: SV11.6 SV11.5 IC6.6
N$114
  Top 0.813: IC6.5 SV11.7 SV11.8
  Bottom 0.813: SV11.8 SV11.7 IC6.5
N$115
  Top 0.813: IC6.4 SV11.9 SV11.10
  Bottom 0.813: SV11.10 SV11.9 IC6.4
N$116
  Top 0.813: IC6.3 SV11.11 SV11.12
  Bottom 0.813: IC6.3 SV11.11 SV11.12
N$117
  Top 0.813: IC6.2 SV11.13 SV11.14
  Bottom 0.813: IC6.2 SV11.13 SV11.14
N$118
  Top 0.813: IC6.1 SV11.15 SV11.16
  Bottom 0.813: SV11.16 SV11.15 IC6.1
N$119
  Top 0.813: IC7.9 SV14.2 SV14.1
  Bottom 0.813: IC7.9 SV14.2 SV14.1
N$120
  Top 0.813: IC7.10 SV14.4 SV14.3
  Bottom 0.813: IC7.10 SV14.4 SV14.3
N$121
  Top 0.813: IC7.11 SV14.6 SV14.5
  Bottom 0.813: IC7.11 SV14.6 SV14.5
N$122
  Top 0.813: IC7.12 SV14.8 SV14.7
  Bottom 0.813: IC7.12 SV14.8 SV14.7
N$123
  Top 0.813: IC7.13 SV14.10 SV14.9
  Bottom 0.813: IC7.13 SV14.10 SV14.9
N$124
  Top 0.813: IC7.14 SV14.12 SV14.11
  Bottom 0.813: IC7.14 SV14.12 SV14.11
N$125
  Top 0.813: IC7.15 SV14.14 SV14.13
  Bottom 0.813: IC7.15 SV14.14 SV14.13
N$126
  Top 0.813: IC7.16 SV14.16 SV14.15
  Bottom 0.813: IC7.16 SV14.16 SV14.15
N$127
  Top 0.813: IC7.8 SV13.1 SV13.2
  Bottom 0.813: SV13.2 SV13.1 IC7.8
N$128
  Top 0.813: IC7.7 SV13.3 SV13.4
  Bottom 0.813: IC7.7 SV13.3 SV13.4
N$129
  Top 0.813: IC7.6 SV13.5 SV13.6
  Bottom 0.813: SV13.6 SV13.5 IC7.6
N$130
  Top 0.813: IC7.5 SV13.7 SV13.8
  Bottom 0.813: IC7.5 SV13.7 SV13.8
N$131
  Top 0.813: IC7.4 SV13.9 SV13.10
  Bottom 0.813: SV13.10 SV13.9 IC7.4
N$132
  Top 0.813: IC7.3 SV13.11 SV13.12
  Bottom 0.813: IC7.3 SV13.11 SV13.12
N$133
  Top 0.813: IC7.2 SV13.13 SV13.14
  Bottom 0.813: SV13.14 SV13.13 IC7.2
N$134
  Top 0.813: IC7.1 SV13.15 SV13.16
  Bottom 0.813: IC7.1 SV13.15 SV13.16
N$135
  Top 0.813: IC8.9 SV16.2 SV16.1
  Bottom 0.813: IC8.9 SV16.2 SV16.1
N$136
  Top 0.813: IC8.10 SV16.4 SV16.3
  Bottom 0.813: SV16.3 SV16.4 IC8.10
N$137
  Top 0.813: IC8.11 SV16.6 SV16.5
  Bottom 0.813: IC8.11 SV16.6 SV16.5
N$138
  Top 0.813: IC8.12 SV16.8 SV16.7
  Bottom 0.813: SV16.7 SV16.8 IC8.12
N$139
  Top 0.813: IC8.13 SV16.10 SV16.9
  Bottom 0.813: IC8.13 SV16.10 SV16.9
N$140
  Top 0.813: IC8.14 SV16.12 SV16.11
  Bottom 0.813: SV16.11 SV16.12 IC8.14
N$141
  Top 0.813: IC8.15 SV16.14 SV16.13
  Bottom 0.813: IC8.15 SV16.14 SV16.13
N$142
  Top 0.813: IC8.16 SV16.16 SV16.15
  Bottom 0.813: SV16.15 SV16.16 IC8.16
N$143
  Top 0.813: IC8.8 SV15.1 SV15.2
  Bottom 0.813: SV15.2 SV15.1 IC8.8
N$144
  Top 0.813: IC8.7 SV15.3 SV15.4
  Bottom 0.813: IC8.7 SV15.3 SV15.4
N$145
  Top 0.813: IC8.6 SV15.5 SV15.6
  Bottom 0.813: SV15.6 SV15.5 IC8.6
N$146
  Top 0.813: IC8.5 SV15.7 SV15.8
  Bottom 0.813: SV15.8 SV15.7 IC8.5
N$147
  Top 0.813: IC8.4 SV15.9 SV15.10
  Bottom 0.813: IC8.4 SV15.9 SV15.10
N$148
  Top 0.813: IC8.3 SV15.11 SV15.12
  Bottom 0.813: SV15.12 SV15.11 IC8.3
N$149
  Top 0.813: IC8.2 SV15.13 SV15.14
  Bottom 0.813: IC8.2 SV15.13 SV15.14
N$150
  Top 0.813: IC8.1 SV15.15 SV15.16
  Bottom 0.813: SV15.16 SV15.15 IC8.1
N$151
  Top 0.813: IC9.9 SV18.2 SV18.1
  Bottom 0.813: IC9.9 SV18.2 SV18.1
N$152
  Top 0.813: IC9.10 SV18.4 SV18.3
  Bottom 0.813: IC9.10 SV18.4 SV18.3
N$153
  Top 0.813: IC9.11 SV18.6 SV18.5
  Bottom 0.813: IC9.11 SV18.6 SV18.5
N$154
  Top 0.813: IC9.12 SV18.8 SV18.7
  Bottom 0.813: IC9.12 SV18.8 SV18.7
N$155
  Top 0.813: IC9.13 SV18.10 SV18.9
  Bottom 0.813: SV18.9 SV18.10 IC9.13
N$156
  Top 0.813: IC9.14 SV18.12 SV18.11
  Bottom 0.813: IC9.14 SV18.12 SV18.11
N$157
  Top 0.813: IC9.15 SV18.14 SV18.13
  Bottom 0.813: SV18.13 SV18.14 IC9.15
N$158
  Top 0.813: IC9.16 SV18.16 SV18.15
  Bottom 0.813: IC9.16 SV18.16 SV18.15
N$159
  Top 0.813: IC9.8 SV17.1 SV17.2
  Bottom 0.813: SV17.2 SV17.1 IC9.8
N$160
  Top 0.813: IC9.7 SV17.3 SV17.4
  Bottom 0.813: IC9.7 SV17.3 SV17.4
N$161
  Top 0.813: IC9.6 SV17.5 SV17.6
  Bottom 0.813: SV17.6 SV17.5 IC9.6
N$162
  Top 0.813: IC9.5 SV17.7 SV17.8
  Bottom 0.813: SV17.8 SV17.7 IC9.5
N$163
  Top 0.813: IC9.4 SV17.9 SV17.10
  Bottom 0.813: IC9.4 SV17.9 SV17.10
N$164
  Top 0.813: IC9.3 SV17.11 SV17.12
  Bottom 0.813: SV17.12 SV17.11 IC9.3
N$165
  Top 0.813: IC9.2 SV17.13 SV17.14
  Bottom 0.813: IC9.2 SV17.13 SV17.14
N$166
  Top 0.813: IC9.1 SV17.15 SV17.16
  Bottom 0.813: SV17.16 SV17.15 IC9.1
N$167
  Top 0.813: IC10.9 SV20.2 SV20.1
  Bottom 0.813: IC10.9 SV20.2 SV20.1
N$168
  Top 0.813: IC10.10 SV20.4 SV20.3
  Bottom 0.813: IC10.10 SV20.4 SV20.3
N$169
  Top 0.813: IC10.11 SV20.6 SV20.5
  Bottom 0.813: IC10.11 SV20.6 SV20.5
N$170
  Top 0.813: IC10.12 SV20.8 SV20.7
  Bottom 0.813: IC10.12 SV20.8 SV20.7
N$171
  Top 0.813: IC10.13 SV20.10 SV20.9
  Bottom 0.813: IC10.13 SV20.10 SV20.9
N$172
  Top 0.813: IC10.14 SV20.12 SV20.11
  Bottom 0.813: IC10.14 SV20.12 SV20.11
N$173
  Top 0.813: IC10.15 SV20.14 SV20.13
  Bottom 0.813: SV20.13 SV20.14 IC10.15
N$174
  Top 0.813: IC10.16 SV20.16 SV20.15
  Bottom 0.813: IC10.16 SV20.16 SV20.15
N$175
  Top 0.813: IC10.8 SV19.1 SV19.2
  Bottom 0.813: SV19.2 SV19.1 IC10.8
N$176
  Top 0.813: IC10.7 SV19.3 SV19.4
  Bottom 0.813: IC10.7 SV19.3 SV19.4
N$177
  Top 0.813: IC10.6 SV19.5 SV19.6
  Bottom 0.813: SV19.6 SV19.5 IC10.6
N$178
  Top 0.813: IC10.5 SV19.7 SV19.8
  Bottom 0.813: IC10.5 SV19.7 SV19.8
N$179
  Top 0.813: IC10.4 SV19.9 SV19.10
  Bottom 0.813: SV19.10 SV19.9 IC10.4
N$180
  Top 0.813: IC10.3 SV19.11 SV19.12
  Bottom 0.813: SV19.12 SV19.11 IC10.3
N$181
  Top 0.813: IC10.2 SV19.13 SV19.14
  Bottom 0.813: SV19.14 SV19.13 IC10.2
N$182
  Top 0.813: IC10.1 SV19.15 SV19.16
  Bottom 0.813: SV19.16 SV19.15 IC10.1
N$183
  Top 0.813: IC11.9 SV22.2 SV22.1
  Bottom 0.813: IC11.9 SV22.2 SV22.1
N$184
  Top 0.813: IC11.10 SV22.4 SV22.3
  Bottom 0.813: IC11.10 SV22.4 SV22.3
N$185
  Top 0.813: IC11.11 SV22.6 SV22.5
  Bottom 0.813: IC11.11 SV22.6 SV22.5
N$186
  Top 0.813: IC11.12 SV22.8 SV22.7
  Bottom 0.813: IC11.12 SV22.8 SV22.7
N$187
  Top 0.813: IC11.13 SV22.10 SV22.9
  Bottom 0.813: IC11.13 SV22.10 SV22.9
N$188
  Top 0.813: IC11.14 SV22.12 SV22.11
  Bottom 0.813: IC11.14 SV22.12 SV22.11
N$189
  Top 0.813: IC11.15 SV22.14 SV22.13
  Bottom 0.813: IC11.15 SV22.14 SV22.13
N$190
  Top 0.813: IC11.16 SV22.16 SV22.15
  Bottom 0.813: IC11.16 SV22.16 SV22.15
N$191
  Top 0.813: IC11.8 SV21.1 SV21.2
  Bottom 0.813: SV21.2 SV21.1 IC11.8
N$192
  Top 0.813: IC11.7 SV21.3 SV21.4
  Bottom 0.813: SV21.4 SV21.3 IC11.7
N$193
  Top 0.813: IC11.6 SV21.5 SV21.6
  Bottom 0.813: SV21.6 SV21.5 IC11.6
N$194
  Top 0.813: IC11.5 SV21.7 SV21.8
  Bottom 0.813: SV21.8 SV21.7 IC11.5
N$195
  Top 0.813: IC11.4 SV21.9 SV21.10
  Bottom 0.813: SV21.10 SV21.9 IC11.4
N$196
  Top 0.813: IC11.3 SV21.11 SV21.12
  Bottom 0.813: SV21.12 SV21.11 IC11.3
N$197
  Top 0.813: IC11.2 SV21.13 SV21.14
  Bottom 0.813: SV21.14 SV21.13 IC11.2
N$198
  Top 0.813: IC11.1 SV21.15 SV21.16
  Bottom 0.813: SV21.16 SV21.15 IC11.1
N$199
  Top 0.813: IC12.9 SV24.2 SV24.1
  Bottom 0.813: IC12.9 SV24.2 SV24.1
N$200
  Top 0.813: IC12.10 SV24.4 SV24.3
  Bottom 0.813: IC12.10 SV24.4 SV24.3
N$201
  Top 0.813: IC12.11 SV24.6 SV24.5
  Bottom 0.813: IC12.11 SV24.6 SV24.5
N$202
  Top 0.813: IC12.12 SV24.8 SV24.7
  Bottom 0.813: IC12.12 SV24.8 SV24.7
N$203
  Top 0.813: IC12.13 SV24.10 SV24.9
  Bottom 0.813: IC12.13 SV24.10 SV24.9
N$204
  Top 0.813: IC12.14 SV24.12 SV24.11
  Bottom 0.813: IC12.14 SV24.12 SV24.11
N$205
  Top 0.813: IC12.15 SV24.14 SV24.13
  Bottom 0.813: SV24.13 SV24.14 IC12.15
N$206
  Top 0.813: IC12.16 SV24.16 SV24.15
  Bottom 0.813: IC12.16 SV24.16 SV24.15
N$207
  Top 0.813: IC12.8 SV23.1 SV23.2
  Bottom 0.813: SV23.2 SV23.1 IC12.8
N$208
  Top 0.813: IC12.7 SV23.3 SV23.4
  Bottom 0.813: SV23.4 SV23.3 IC12.7
N$209
  Top 0.813: IC12.6 SV23.5 SV23.6
  Bottom 0.813: SV23.6 SV23.5 IC12.6
N$210
  Top 0.813: IC12.5 SV23.7 SV23.8
  Bottom 0.813: SV23.8 SV23.7 IC12.5
N$211
  Top 0.813: IC12.4 SV23.9 SV23.10
  Bottom 0.813: SV23.10 SV23.9 IC12.4
N$212
  Top 0.813: IC12.3 SV23.11 SV23.12
  Bottom 0.813: SV23.12 SV23.11 IC12.3
N$213
  Top 0.813: IC12.2 SV23.13 SV23.14
  Bottom 0.813: SV23.14 SV23.13 IC12.2
N$214
  Top 0.813: IC12.1 SV23.15 SV23.16
  Bottom 0.813: SV23.16 SV23.15 IC12.1
N$215
  Top 0.813: IC13.9 SV26.2 SV26.1
  Bottom 0.813: IC13.9 SV26.2 SV26.1
N$216
  Top 0.813: IC13.10 SV26.4 SV26.3
  Bottom 0.813: IC13.10 SV26.4 SV26.3
N$217
  Top 0.813: IC13.11 SV26.6 SV26.5
  Bottom 0.813: SV26.5 SV26.6 IC13.11
N$218
  Top 0.813: IC13.12 SV26.8 SV26.7
  Bottom 0.813: SV26.7 SV26.8 IC13.12
N$219
  Top 0.813: IC13.13 SV26.10 SV26.9
  Bottom 0.813: IC13.13 SV26.10 SV26.9
N$220
  Top 0.813: IC13.14 SV26.12 SV26.11
  Bottom 0.813: IC13.14 SV26.12 SV26.11
N$221
  Top 0.813: IC13.15 SV26.14 SV26.13
  Bottom 0.813: IC13.15 SV26.14 SV26.13
N$222
  Top 0.813: IC13.16 SV26.16 SV26.15
  Bottom 0.813: IC13.16 SV26.16 SV26.15
N$223
  Top 0.813: IC13.8 SV25.1 SV25.2
  Bottom 0.813: SV25.2 SV25.1 IC13.8
N$224
  Top 0.813: IC13.7 SV25.3 SV25.4
  Bottom 0.813: IC13.7 SV25.3 SV25.4
N$225
  Top 0.813: IC13.6 SV25.5 SV25.6
  Bottom 0.813: SV25.6 SV25.5 IC13.6
N$226
  Top 0.813: IC13.5 SV25.7 SV25.8
  Bottom 0.813: IC13.5 SV25.7 SV25.8
N$227
  Top 0.813: IC13.4 SV25.9 SV25.10
  Bottom 0.813: SV25.10 SV25.9 IC13.4
N$228
  Top 0.813: IC13.3 SV25.11 SV25.12
  Bottom 0.813: IC13.3 SV25.11 SV25.12
N$229
  Top 0.813: IC13.2 SV25.13 SV25.14
  Bottom 0.813: SV25.14 SV25.13 IC13.2
N$230
  Top 0.813: IC13.1 SV25.15 SV25.16
  Bottom 0.813: IC13.1 SV25.15 SV25.16
N$231
  Top 0.813: IC14.9 SV28.2 SV28.1
  Bottom 0.813: IC14.9 SV28.2 SV28.1
N$232
  Top 0.813: IC14.10 SV28.4 SV28.3
  Bottom 0.813: SV28.3 SV28.4 IC14.10
N$233
  Top 0.813: IC14.11 SV28.6 SV28.5
  Bottom 0.813: IC14.11 SV28.6 SV28.5
N$234
  Top 0.813: IC14.12 SV28.8 SV28.7
  Bottom 0.813: SV28.7 SV28.8 IC14.12
N$235
  Top 0.813: IC14.13 SV28.10 SV28.9
  Bottom 0.813: IC14.13 SV28.10 SV28.9
N$236
  Top 0.813: IC14.14 SV28.12 SV28.11
  Bottom 0.813: SV28.11 SV28.12 IC14.14
N$237
  Top 0.813: IC14.15 SV28.14 SV28.13
  Bottom 0.813: IC14.15 SV28.14 SV28.13
N$238
  Top 0.813: IC14.16 SV28.16 SV28.15
  Bottom 0.813: IC14.16 SV28.16 SV28.15
N$239
  Top 0.813: IC14.8 SV27.1 SV27.2
  Bottom 0.813: SV27.2 SV27.1 IC14.8
N$240
  Top 0.813: IC14.7 SV27.3 SV27.4
  Bottom 0.813: IC14.7 SV27.3 SV27.4
N$241
  Top 0.813: IC14.6 SV27.5 SV27.6
  Bottom 0.813: SV27.6 SV27.5 IC14.6
N$242
  Top 0.813: IC14.5 SV27.7 SV27.8
  Bottom 0.813: SV27.8 SV27.7 IC14.5
N$243
  Bottom 0.406: SV122.2 SV121.1
N$244
  Bottom 0.406: SV122.4 SV121.3
N$245
  Bottom 0.406: SV122.6 SV121.5
N$246
  Bottom 0.813: SV122.8 SV121.7
N$247
  Top 0.813: IC14.4 SV27.9 SV27.10
  Bottom 0.813: IC14.4 SV27.9 SV27.10
N$248
  Top 0.813: IC14.3 SV27.11 SV27.12
  Bottom 0.813: SV27.12 SV27.11 IC14.3
N$249
  Top 0.813: IC14.2 SV27.13 SV27.14
  Bottom 0.813: IC14.2 SV27.13 SV27.14
N$250
  Top 0.813: IC14.1 SV27.15 SV27.16
  Bottom 0.813: SV27.16 SV27.15 IC14.1
N$251
  Top 0.813: IC15.9 SV30.2 SV30.1
  Bottom 0.813: IC15.9 SV30.2 SV30.1
N$252
  Top 0.813: IC15.10 SV30.4 SV30.3
  Bottom 0.813: IC15.10 SV30.4 SV30.3
N$253
  Top 0.813: IC15.11 SV30.6 SV30.5
  Bottom 0.813: IC15.11 SV30.6 SV30.5
N$254
  Top 0.813: IC15.12 SV30.8 SV30.7
  Bottom 0.813: SV30.7 SV30.8 IC15.12
N$255
  Top 0.813: IC15.13 SV30.10 SV30.9
  Bottom 0.813: IC15.13 SV30.10 SV30.9
N$256
  Top 0.813: IC15.14 SV30.12 SV30.11
  Bottom 0.813: IC15.14 SV30.12 SV30.11
N$257
  Top 0.813: IC15.15 SV30.14 SV30.13
  Bottom 0.813: SV30.13 SV30.14 IC15.15
N$258
  Top 0.813: IC15.16 SV30.16 SV30.15
  Bottom 0.813: IC15.16 SV30.16 SV30.15
N$259